# Altium schematic sheet 3.3V_SUPPLY.SchDoc
size A4; SheetNumber: 4; SheetTotal: 11
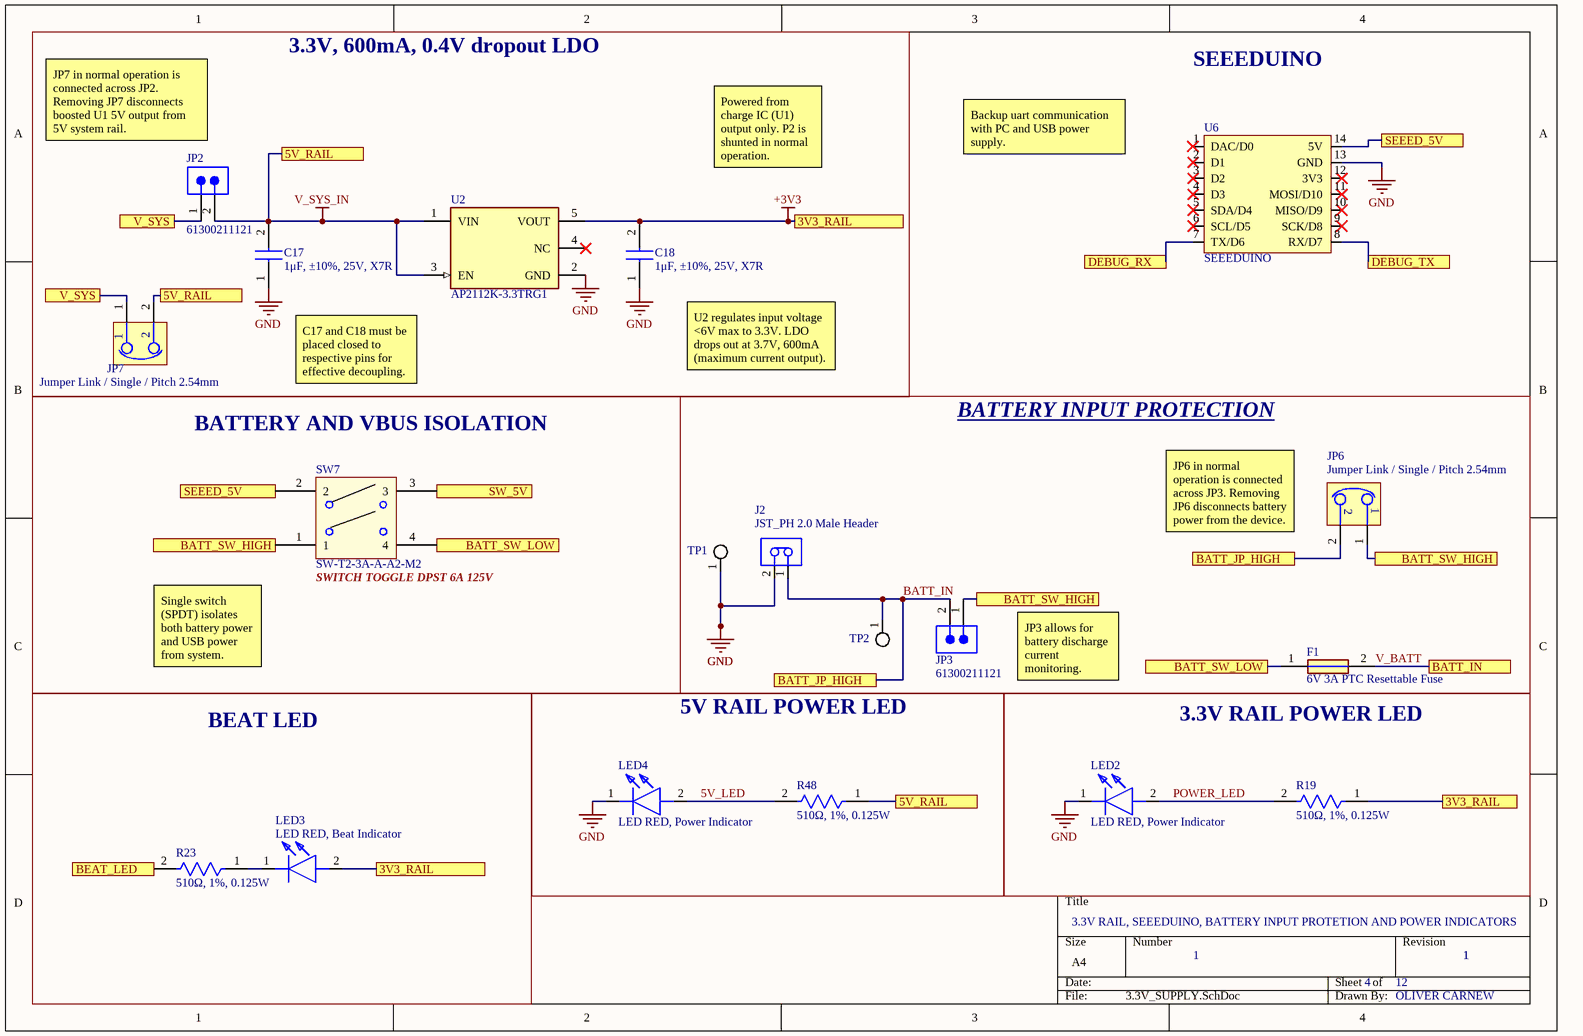
[diagram p0: 3.3V_SUPPLY.SchDoc]

## Parts
C17  1μF, ±10%, 25V, X7R  [CAPC1608X90N]
C18  1μF, ±10%, 25V, X7R  [CAPC1608X90N]
F1  6V 3A PTC Resettable Fuse  [FUSC4632X155N]
J2  JST_PH 2.0 Male Header  [JST-B2B-PH-K-S_V]
JP2  61300211121  [61300211121]
JP3  61300211121  [61300211121]
JP6  Jumper Link / Single / Pitch 2.54mm
JP7  Jumper Link / Single / Pitch 2.54mm
LED2  LED RED, Power Indicator  [LEDC2012X90N]
LED3  LED RED, Beat Indicator  [LEDC2012X90N]
LED4  LED RED, Power Indicator  [LEDC2012X90N]
R19  510Ω, 1%, 0.125W  [FP-CRCW0805-e3-IPC_B]
R23  510Ω, 1%, 0.125W  [FP-CRCW0805-e3-IPC_B]
R48  510Ω, 1%, 0.125W  [FP-CRCW0805-e3-IPC_B]
SW7  SW-T2-3A-A-A2-M2  [SWITCH_PCB_MOUNT]
TP1  Small testpoint 40mil  [TEST_POINT_SMALL]  (value not drawn)
TP2  Small testpoint 40mil  [TEST_POINT_SMALL]  (value not drawn)
U2  AP2112K-3.3TRG1  [FP-SOT25-MFG]
U6  SEEEDUINO  [XIAO - 6mm annular]

## Blocks framed on the sheet
3.3V, 600mA, 0.4V dropout LDO: C17 C18 JP2 JP7 U2
BATTERY AND VBUS ISOLATION: SW7
BATTERY INPUT PROTECTION: F1 J2 JP3 JP6 TP1 TP2
BEAT LED: LED3 R23
5V RAIL POWER LED: LED4 R48
3.3V RAIL POWER LED: LED2 R19

## Ports
3V3_RAIL, 5V_RAIL, BATT_IN, BATT_JP_HIGH, BATT_SW_HIGH, BATT_SW_LOW, BEAT_LED, DEBUG_RX, DEBUG_TX, SEEED_5V, SW_5V, V_SYS

## Nets
+3V3: C18.2 LED3.2(A) R19.1 U2.5(VOUT) ; port 3V3_RAIL
GND: C17.1 C18.1 J2.2 LED2.1(K) LED4.1(K) TP1.1 U2.2(GND) U6.13(GND)
V_SYS_IN: C17.2 JP2.2 JP7.2 R48.1 U2.1(VIN) U2.3(EN) ; port 5V_RAIL
5V_LED: LED4.2(A) R48.2
BATT_IN: J2.1 JP3.2 JP6.2 TP2.1 ; port BATT_JP_HIGH
BATT_SW_HIGH: JP3.1 JP6.1 SW7.1 ; port BATT_SW_HIGH
BATT_SW_LOW: F1.1 SW7.4 ; port BATT_SW_LOW
BEAT_LED: R23.2 ; port BEAT_LED
DEBUG_RX: U6.7(TX/D6) ; port DEBUG_RX
DEBUG_TX: U6.8(RX/D7) ; port DEBUG_TX
POWER_LED: LED2.2(A) R19.2
SEEED_5V: SW7.2 U6.14(5V) ; port SEEED_5V
SW_5V: SW7.3 ; port SW_5V
V_BATT: F1.2 ; port BATT_IN
V_SYS: JP2.1 JP7.1 ; port V_SYS
NetLED3_1: LED3.1(K) R23.1

Not connected (* = marked no-connect by the designer): U2 4(NC)*; U6 1(DAC/D0)* 2(D1)* 3(D2)* 4(D3)* 5(SDA/D4)* 6(SCL/D5)* 9(SCK/D8)* 10(MISO/D9)* 11(MOSI/D10)* 12(3V3)*

## Notes on the sheet
- SEEEDUINO
- JP7 in normal operation is connected across JP2. Removing JP7 disconnects boosted U1 5V output from 5V system rail.
- Powered from charge IC (U1) output only. P2 is shunted in normal operation.
- Backup uart communication with PC and USB power supply.
- C17 and C18 must be placed closed to respective pins for effective decoupling.
- U2 regulates input voltage <6V max to 3.3V. LDO drops out at 3.7V, 600mA (maximum current output).
- (near SW7) SWITCH TOGGLE DPST 6A 125V
- (near JP6) JP6 in normal operation is connected across JP3. Removing JP6 disconnects battery power from the device.
- Single switch (SPDT) isolates both battery power and USB power from system.
- JP3 allows for battery discharge current monitoring.
- 3.3V RAIL, SEEEDUINO, BATTERY INPUT PROTETION AND POWER INDICATORS
- 1
- 4
- 12
- OLIVER CARNEW

## Library data of the parts
C17 C18 = CL10B105KA8NNNC: Capacitor 1 µF ±10% 25V Ceramic Capacitor X7R 0603 (1608 Metric) CL10B105KA8NNNC; Manufacturer_Name: SAMSUNG; Datasheet Link: https://datasheet.datasheetarchive.com/originals/distributors/Datasheets-DGA10/2410489.pdf; Height: 0.9mm; Manufacturer_Part_Number: CL10B105KA8NNNC; Mouser Part Number: 187-CL10B105KA8NNNC; Mouser Price/Stock: https://www.mouser.co.uk/ProductDetail/Samsung-Electro-Mechanics/CL10B105KA8NNNC?qs=349EhDEZ59qp%252BMgnTol5Nw%3D%3D; Arrow Part Number: CL10B105KA8NNNC; Arrow Price/Stock: https://www.arrow.com/en/products/cl10b105ka8nnnc/samsung-electro-mechanics?region=nac; Parameter 1: 1 µF ±10% 25V Ceramic Capacitor X7R 0603 (1608 Metric)
F1 = 0ZCG0300FF2B: Polymeric PTC Resettable Fuse 6V 3 A Ih Surface Mount 1812 (4532 Metric), Concave; Manufacturer_Name: BelFuse; Datasheet Link: https://datasheet.datasheetarchive.com/originals/distributors/Datasheets_SAMA/44944b3a27f8483a7253631e04029a1a.pdf; Height: 1.55mm; Manufacturer_Part_Number: 0ZCG0300FF2B; Mouser Part Number: 530-0ZCG0300FF2B; Mouser Price/Stock: https://www.mouser.co.uk/ProductDetail/Bel-Fuse/0ZCG0300FF2B?qs=SRYZG9HaIQ05yXZrpiJOLQ%3D%3D; Arrow Part Number: 0ZCG0300FF2B; Arrow Price/Stock: https://www.arrow.com/en/products/0zcg0300ff2b/bel-group
J2 = CMP-2000-05162-1: Male Header, Pitch 2 mm, 1 x 2 Position, Height 6 mm, Tail Length 3.4 mm, -25 to 85 degC, RoHS, Bulk B2B-PH-K-S(LF)(SN); Manufacturer: JST; Pitch: 2mm; Style/Orientation: StraightHeader/Plug; No of Positions: 2; Datasheet Version: Nov-08; Datasheet URL: http://datasheet.octopart.com/B2B-PH-K-S%28LF%29%28SN%29-JST-datasheet-8324864.pdf; Manufacturer URL: http://www.jst.com/home2.html; Type: ShroudedHeader; Termination: Crimp
JP2 JP3 = CMP-1712-00002-6: NexarPartId: 20081794; Number of Contacts: 2; Pitch: 2.54mm; Connector Type: Male Pin; Voltage Rating: 250V; Current Rating: 3A; Gender: Male; Contact Resistance: 20mΩ; Height: 8.94mm; Lead Free: Lead Free; Number of Pins: 2; Termination: Through Hole; RoHS: Compliant; Lead Pitch: 2.54mm; REACH SVHC: No SVHC; Housing Material: PBT; Contact Mating Length: 5.9944mm; Min Operating Temperature: -40°C; Orientation: Vertical; Contact Material: Copper; Contact Gender: Male; Max Operating Temperature: 125°C; Number of Rows: 1; Number of Positions: 2; Packaging: Bulk; Contact Plating: Gold; Mount: Through Hole; Color: Black; Operating Supply Voltage: 250V
JP6 JP7 = jumper_2.54mm: CONNECTOR : PCB Jumper Link / Single / Pitch 2.54mm / Black /shunt.  01-96-02
LED2 = MCL-S270SRC: Manufacturer_Name: Multicomp Pro; Datasheet Link: https://www.farnell.com/datasheets/2861594.pdf; Height: 0.9mm; Manufacturer_Part_Number: MCL-S270SRC
LED3 = MCL-S270SRC: LED MCL-S270SRC; Manufacturer_Name: Multicomp Pro; Datasheet Link: https://www.farnell.com/datasheets/2861594.pdf; Height: 0.9mm; Manufacturer_Part_Number: MCL-S270SRC
LED4 = MCL-S270SRC: LED; Manufacturer_Name: Multicomp Pro; Datasheet Link: https://www.farnell.com/datasheets/2861594.pdf; Height: 0.9mm; Manufacturer_Part_Number: MCL-S270SRC
R19 R23 R48 = CMP-2001-03989-2: RES Thick Film, 510Ω, 1%, 0.125W, 100ppm/°C, 0805 CRCW0805510RFKEA; Power Rating: 125mW; Voltage Rating (DC): 150V; Resistance: 510R; Tolerance: 1%; Weight: 0.000194oz; Case Code (Metric): 2012; Packaging: Tape and Reel; Case/Package: 0805; Case Code (Imperial): 0805; Width: 0.049inch; Military Standard: Not; Radiation Hardening: No; Min Operating Temperature: -55°C; Length: 2mm; Termination: SMD/SMT; Max Operating Temperature: 155°C; Height: 0.45mm; Contact Plating: Tin; Lead Free: Lead Free; Voltage Rating: 150V; Composition: Thick Film; Max Power Dissipation: 125mW; Package Quantity: 10; Features: Automotive AEC-Q200; Mount: Surface Mount; Depth: 1.25mm; Temperature Coefficient: 100ppm/°C; Number of Terminations: 2
SW7 = SWITCH_PANEL MOUNT: DPST SWITCH TOGGLE DPST 6A 125V SW-T2-3A-A-A2-M2
TP1 TP2 = TEST_POINT_SMALL: 40mil circular pad no hole
U2 = CMP-12756-000035-1: IC REG LINEAR 3.3V 600MA SOT25 AP2112K-3.3TRG1; Number of Regulators: 1; Output Type: Fixed; Polarity: Positive; Min Input Voltage: 2.5V; Max Input Voltage: 6V; Accuracy: 1.5%; Quiescent Current: 55uA; Dropout Voltage: 250mV; Min Operating Temperature: -40°C; Length: 3.1mm; Output Current: 600mA; Max Operating Temperature: 85°C; Package Quantity: 1; Output Voltage: 3.3V; Width: 1.7mm; Number of Outputs: 1; Packaging: Tape and Reel; Height: 1.3mm; Lead Free: Lead Free; Max Output Current: 600mA; Case/Package: SOT-23-5; Mount: Surface Mount; Number of Pins: 5
U6 = SEEEDUINO: SAMD21 Microcontroller Development Board 0.0327MHz/48MHzCPU 32KB RAM 256KB Flash; Manufacturer: Seeed Studio; Manufacturer Part Number: 102010328; Evaluation Kit: Yes; Core Architecture: ARM; Supplier 1: Digikey; RoHS: No; Category: DSPs - Digital Signal Processors; Stock 1: 2211; Pricing 1: 1=5.4 (USD); Series: SAM D; ComponentLink1URL: https://media.digikey.com/pdf/Data%20Sheets/Seeed%20Technology/102010328_Web.pdf?src-supplier=Digikey; ComponentLink1Description: https://media.digikey.com/pdf/Data%20Sheets/Seeed%20Technology/102010328_Web.pdf?src-supplier=Digikey; Supplier Part Number 1: 1597-102010328-ND